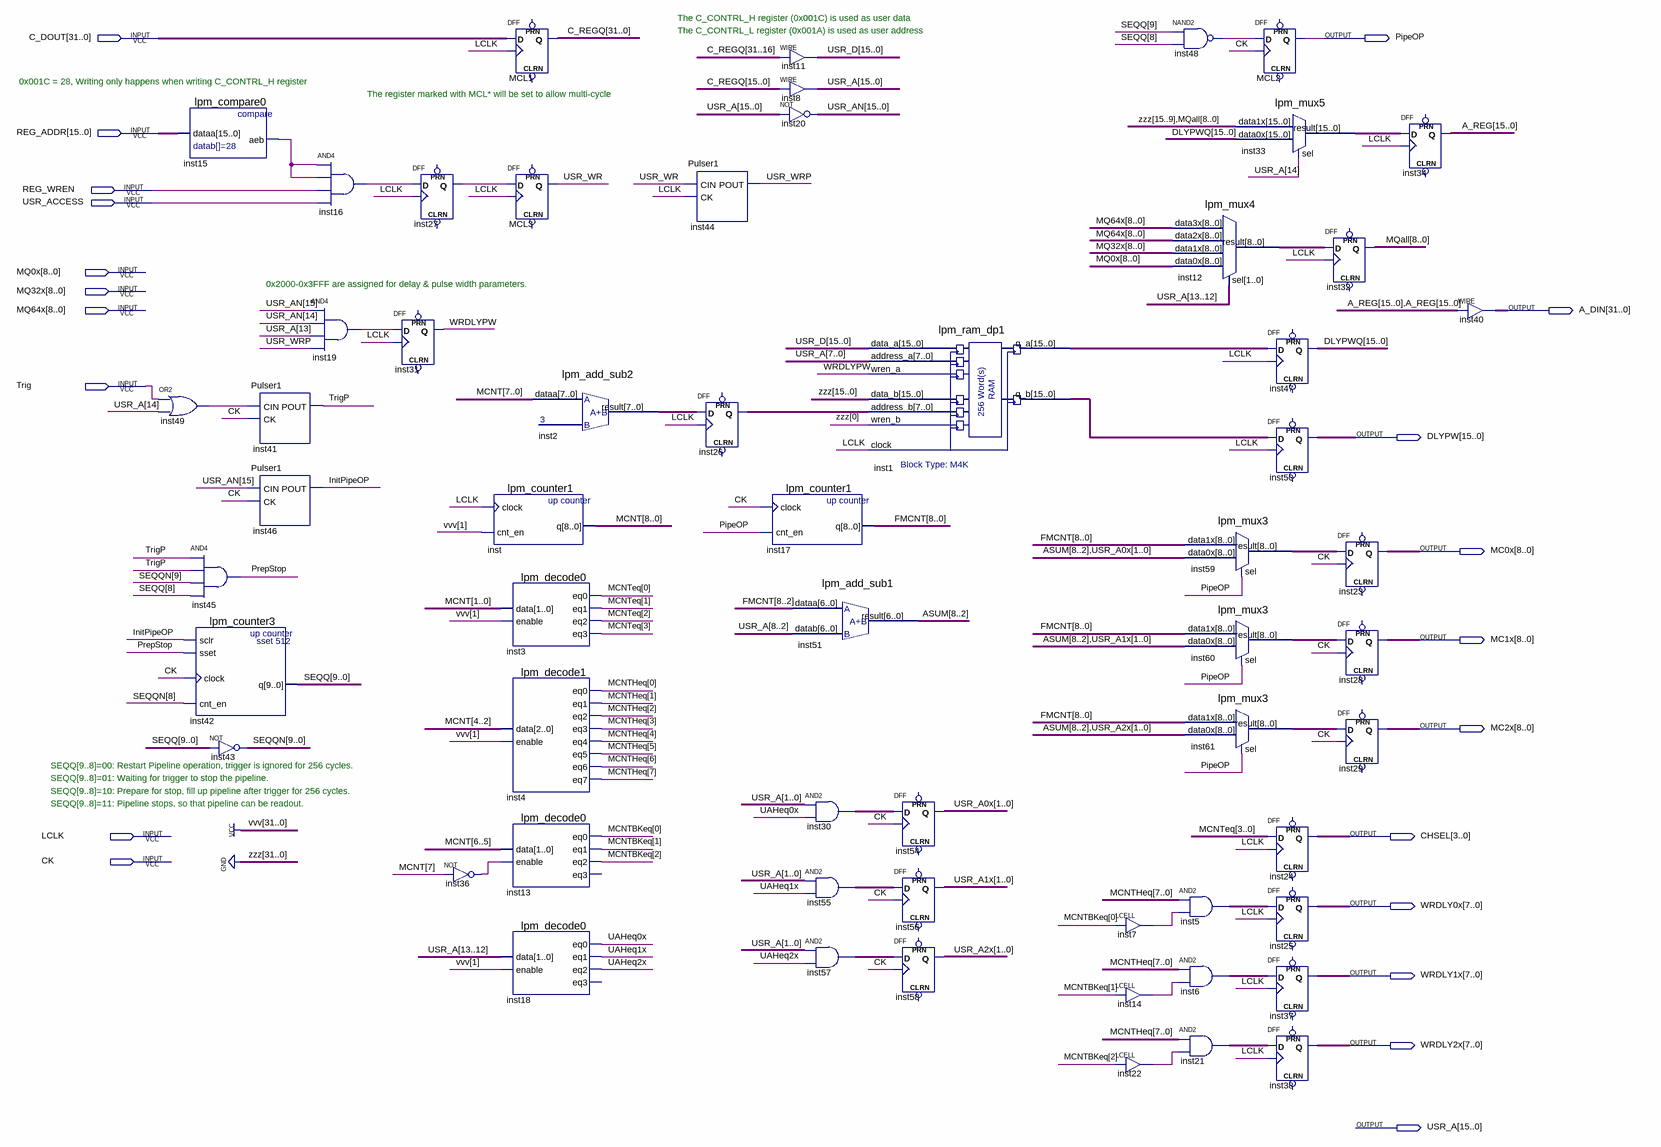
[diagram p0: schematic sheet]
// Quartus schematic Timing1.bdf as structural Verilog: 59 symbols, 21 pins
module Timing1 (
  input  [31:0] C_DOUT,
  input  [15:0] REG_ADDR,
  input  REG_WREN,
  input  USR_ACCESS,
  input  [8:0] MQ0x,
  input  [8:0] MQ32x,
  input  [8:0] MQ64x,
  input  Trig,
  input  LCLK,
  input  CK,
  output PipeOP,
  output [31:0] A_DIN,
  output [15:0] DLYPW,
  output [8:0] MC0x,
  output [8:0] MC1x,
  output [8:0] MC2x,
  output [3:0] CHSEL,
  output [7:0] WRDLY0x,
  output [7:0] WRDLY1x,
  output [7:0] WRDLY2x,
  output [15:0] USR_A
);

  wire InitPipeOP, inst7_out, inst14_out, inst15_aeb, inst16_out, inst19_out, inst22_out, inst27_q,
       inst36_out, inst48_out, inst49_out, PrepStop, TrigP, UAHeq0x, UAHeq1x, UAHeq2x, USR_WR, USR_WRP,
       WRDLYPW;
  wire [1:0] inst30_out, inst55_out, inst57_out, USR_A0x, USR_A1x, USR_A2x;
  wire [2:0] MCNTBKeq;
  wire [3:0] MCNTeq;
  wire [7:0] inst2_result, inst5_out, inst6_out, inst21_out, inst26_q, MCNTHeq;
  wire [8:0] FMCNT, inst12_result, inst59_result, inst60_result, inst61_result, MCNT, MQall;
  wire [8:2] ASUM;
  wire [9:0] SEQQ, SEQQN;
  wire [15:0] A_REG, DLYPWQ, inst1_q_a, inst1_q_b, inst33_result, USR_AN, USR_D;
  wire [31:0] C_REGQ;

  lpm_compare0 inst15 (.dataa(REG_ADDR), .aeb(inst15_aeb));
  or inst49 (inst49_out, Trig, USR_A[14]);
  and inst45 (PrepStop, TrigP, TrigP, SEQQN[9], SEQQ[8]);
  lpm_counter3 inst42 (.sclr(InitPipeOP), .sset(PrepStop), .clock(CK), .cnt_en(SEQQN[8]), .q(SEQQ));
  assign SEQQN = ~SEQQ;  // NOT inst43, 10 bits wide
  Pulser1 inst41 (.CIN(inst49_out), .CK(CK), .POUT(TrigP));
  Pulser1 inst46 (.CIN(USR_AN[15]), .CK(CK), .POUT(InitPipeOP));
  and inst16 (inst16_out, inst15_aeb, inst15_aeb, REG_WREN, USR_ACCESS);
  and inst19 (inst19_out, USR_AN[15], USR_AN[14], USR_A[13], USR_WRP);
  DFF inst27 (.CLK(LCLK), .D(inst16_out), .Q(inst27_q));  // open: CLRN, PRN
  DFF inst31 (.CLK(LCLK), .D(inst19_out), .Q(WRDLYPW));  // open: CLRN, PRN
  lpm_counter1 inst (.clock(LCLK), .cnt_en(1'b1), .q(MCNT));
  not inst36 (inst36_out, MCNT[7]);
  DFF MCL1[31:0] (.CLK(LCLK), .D(C_DOUT), .Q(C_REGQ));  // open: CLRN, PRN
  DFF MCL3 (.CLK(LCLK), .D(inst27_q), .Q(USR_WR));  // open: CLRN, PRN
  lpm_add_sub2 inst2 (.dataa(MCNT[7:0]), .result(inst2_result));
  lpm_decode0 inst3 (
    .data(MCNT[1:0]), .enable(1'b1), .eq0(MCNTeq[0]), .eq1(MCNTeq[1]), .eq2(MCNTeq[2]), .eq3(MCNTeq[3]));
  lpm_decode1 inst4 (
    .data(MCNT[4:2]), .enable(1'b1), .eq0(MCNTHeq[0]), .eq1(MCNTHeq[1]), .eq2(MCNTHeq[2]), .eq3(MCNTHeq[3]),
    .eq4(MCNTHeq[4]), .eq5(MCNTHeq[5]), .eq6(MCNTHeq[6]), .eq7(MCNTHeq[7]));
  lpm_decode0 inst13 (
    .data(MCNT[6:5]), .enable(inst36_out), .eq0(MCNTBKeq[0]), .eq1(MCNTBKeq[1]), .eq2(MCNTBKeq[2]));  // open: eq3
  lpm_decode0 inst18 (.data(USR_A[13:12]), .enable(1'b1), .eq0(UAHeq0x), .eq1(UAHeq1x), .eq2(UAHeq2x));  // open: eq3
  Pulser1 inst44 (.CIN(USR_WR), .CK(LCLK), .POUT(USR_WRP));
  DFF inst26[7:0] (.CLK(LCLK), .D(inst2_result), .Q(inst26_q));  // open: CLRN, PRN
  assign USR_D = C_REGQ[31:16];  // WIRE inst11
  assign USR_A = C_REGQ[15:0];  // WIRE inst8
  assign USR_AN = ~USR_A;  // NOT inst20, 16 bits wide
  lpm_counter1 inst17 (.clock(CK), .cnt_en(PipeOP), .q(FMCNT));
  lpm_add_sub1 inst51 (.dataa(FMCNT[8:2]), .datab(USR_A[8:2]), .result(ASUM));
  assign inst30_out = USR_A[1:0] & {2{UAHeq0x}};  // AND2 inst30, 2 bits wide
  assign inst55_out = USR_A[1:0] & {2{UAHeq1x}};  // AND2 inst55, 2 bits wide
  assign inst57_out = USR_A[1:0] & {2{UAHeq2x}};  // AND2 inst57, 2 bits wide
  lpm_ram_dp1 inst1 (
    .data_a(USR_D), .address_a(USR_A[7:0]), .wren_a(WRDLYPW), .data_b({16{1'b0}}), .address_b(inst26_q),
    .wren_b(1'b0), .clock(LCLK), .q_a(inst1_q_a), .q_b(inst1_q_b));
  DFF inst54[1:0] (.CLK(CK), .D(inst30_out), .Q(USR_A0x));  // open: CLRN, PRN
  DFF inst56[1:0] (.CLK(CK), .D(inst55_out), .Q(USR_A1x));  // open: CLRN, PRN
  DFF inst58[1:0] (.CLK(CK), .D(inst57_out), .Q(USR_A2x));  // open: CLRN, PRN
  LCELL inst7 (.IN(MCNTBKeq[0]), .OUT(inst7_out));
  LCELL inst14 (.IN(MCNTBKeq[1]), .OUT(inst14_out));
  LCELL inst22 (.IN(MCNTBKeq[2]), .OUT(inst22_out));
  nand inst48 (inst48_out, SEQQ[9], SEQQ[8]);
  lpm_mux4 inst12 (
    .data3x(MQ64x), .data2x(MQ64x), .data1x(MQ32x), .data0x(MQ0x), .sel(USR_A[13:12]), .result(inst12_result));
  lpm_mux3 inst59 (.data1x(FMCNT), .data0x({ASUM, USR_A0x}), .sel(PipeOP), .result(inst59_result));
  lpm_mux3 inst60 (.data1x(FMCNT), .data0x({ASUM, USR_A1x}), .sel(PipeOP), .result(inst60_result));
  lpm_mux3 inst61 (.data1x(FMCNT), .data0x({ASUM, USR_A2x}), .sel(PipeOP), .result(inst61_result));
  assign inst5_out = MCNTHeq & {8{inst7_out}};  // AND2 inst5, 8 bits wide
  assign inst6_out = MCNTHeq & {8{inst14_out}};  // AND2 inst6, 8 bits wide
  assign inst21_out = MCNTHeq & {8{inst22_out}};  // AND2 inst21, 8 bits wide
  lpm_mux5 inst33 (.data1x({{7{1'b0}}, MQall}), .data0x(DLYPWQ), .sel(USR_A[14]), .result(inst33_result));
  DFF MCL2 (.CLK(CK), .D(inst48_out), .Q(PipeOP));  // open: CLRN, PRN
  DFF inst47[15:0] (.CLK(LCLK), .D(inst1_q_a), .Q(DLYPWQ));  // open: CLRN, PRN
  DFF inst50[15:0] (.CLK(LCLK), .D(inst1_q_b), .Q(DLYPW));  // open: CLRN, PRN
  DFF inst24[3:0] (.CLK(LCLK), .D(MCNTeq), .Q(CHSEL));  // open: CLRN, PRN
  DFF inst25[7:0] (.CLK(LCLK), .D(inst5_out), .Q(WRDLY0x));  // open: CLRN, PRN
  DFF inst37[7:0] (.CLK(LCLK), .D(inst6_out), .Q(WRDLY1x));  // open: CLRN, PRN
  DFF inst38[7:0] (.CLK(LCLK), .D(inst21_out), .Q(WRDLY2x));  // open: CLRN, PRN
  DFF inst32[8:0] (.CLK(LCLK), .D(inst12_result), .Q(MQall));  // open: CLRN, PRN
  DFF inst23[8:0] (.CLK(CK), .D(inst59_result), .Q(MC0x));  // open: CLRN, PRN
  DFF inst28[8:0] (.CLK(CK), .D(inst60_result), .Q(MC1x));  // open: CLRN, PRN
  DFF inst29[8:0] (.CLK(CK), .D(inst61_result), .Q(MC2x));  // open: CLRN, PRN
  DFF inst34[15:0] (.CLK(LCLK), .D(inst33_result), .Q(A_REG));  // open: CLRN, PRN
  assign A_DIN = {A_REG, A_REG};  // WIRE inst40

  // Notes on the sheet:
  //   The C_CONTRL_H register (0x001C) is used as user data
  //   The C_CONTRL_L register (0x001A) is used as user address
  //   0x001C = 28, Writing only happens when writing C_CONTRL_H register
  //   The register marked with MCL* will be set to allow multi-cycle
  //   0x2000-0x3FFF are assigned for delay & pulse width parameters.
  //   SEQQ[9..8]=00: Restart Pipeline operation, trigger is ignored for 256 cycles.
  //   SEQQ[9..8]=01: Waiting for trigger to stop the pipeline.
  //   SEQQ[9..8]=10: Prepare for stop, fill up pipeline after trigger for 256 cycles.
  //   SEQQ[9..8]=11: Pipeline stops, so that pipeline can be readout.
endmodule
